# Altium schematic sheet rampshh.SchDoc
size A3
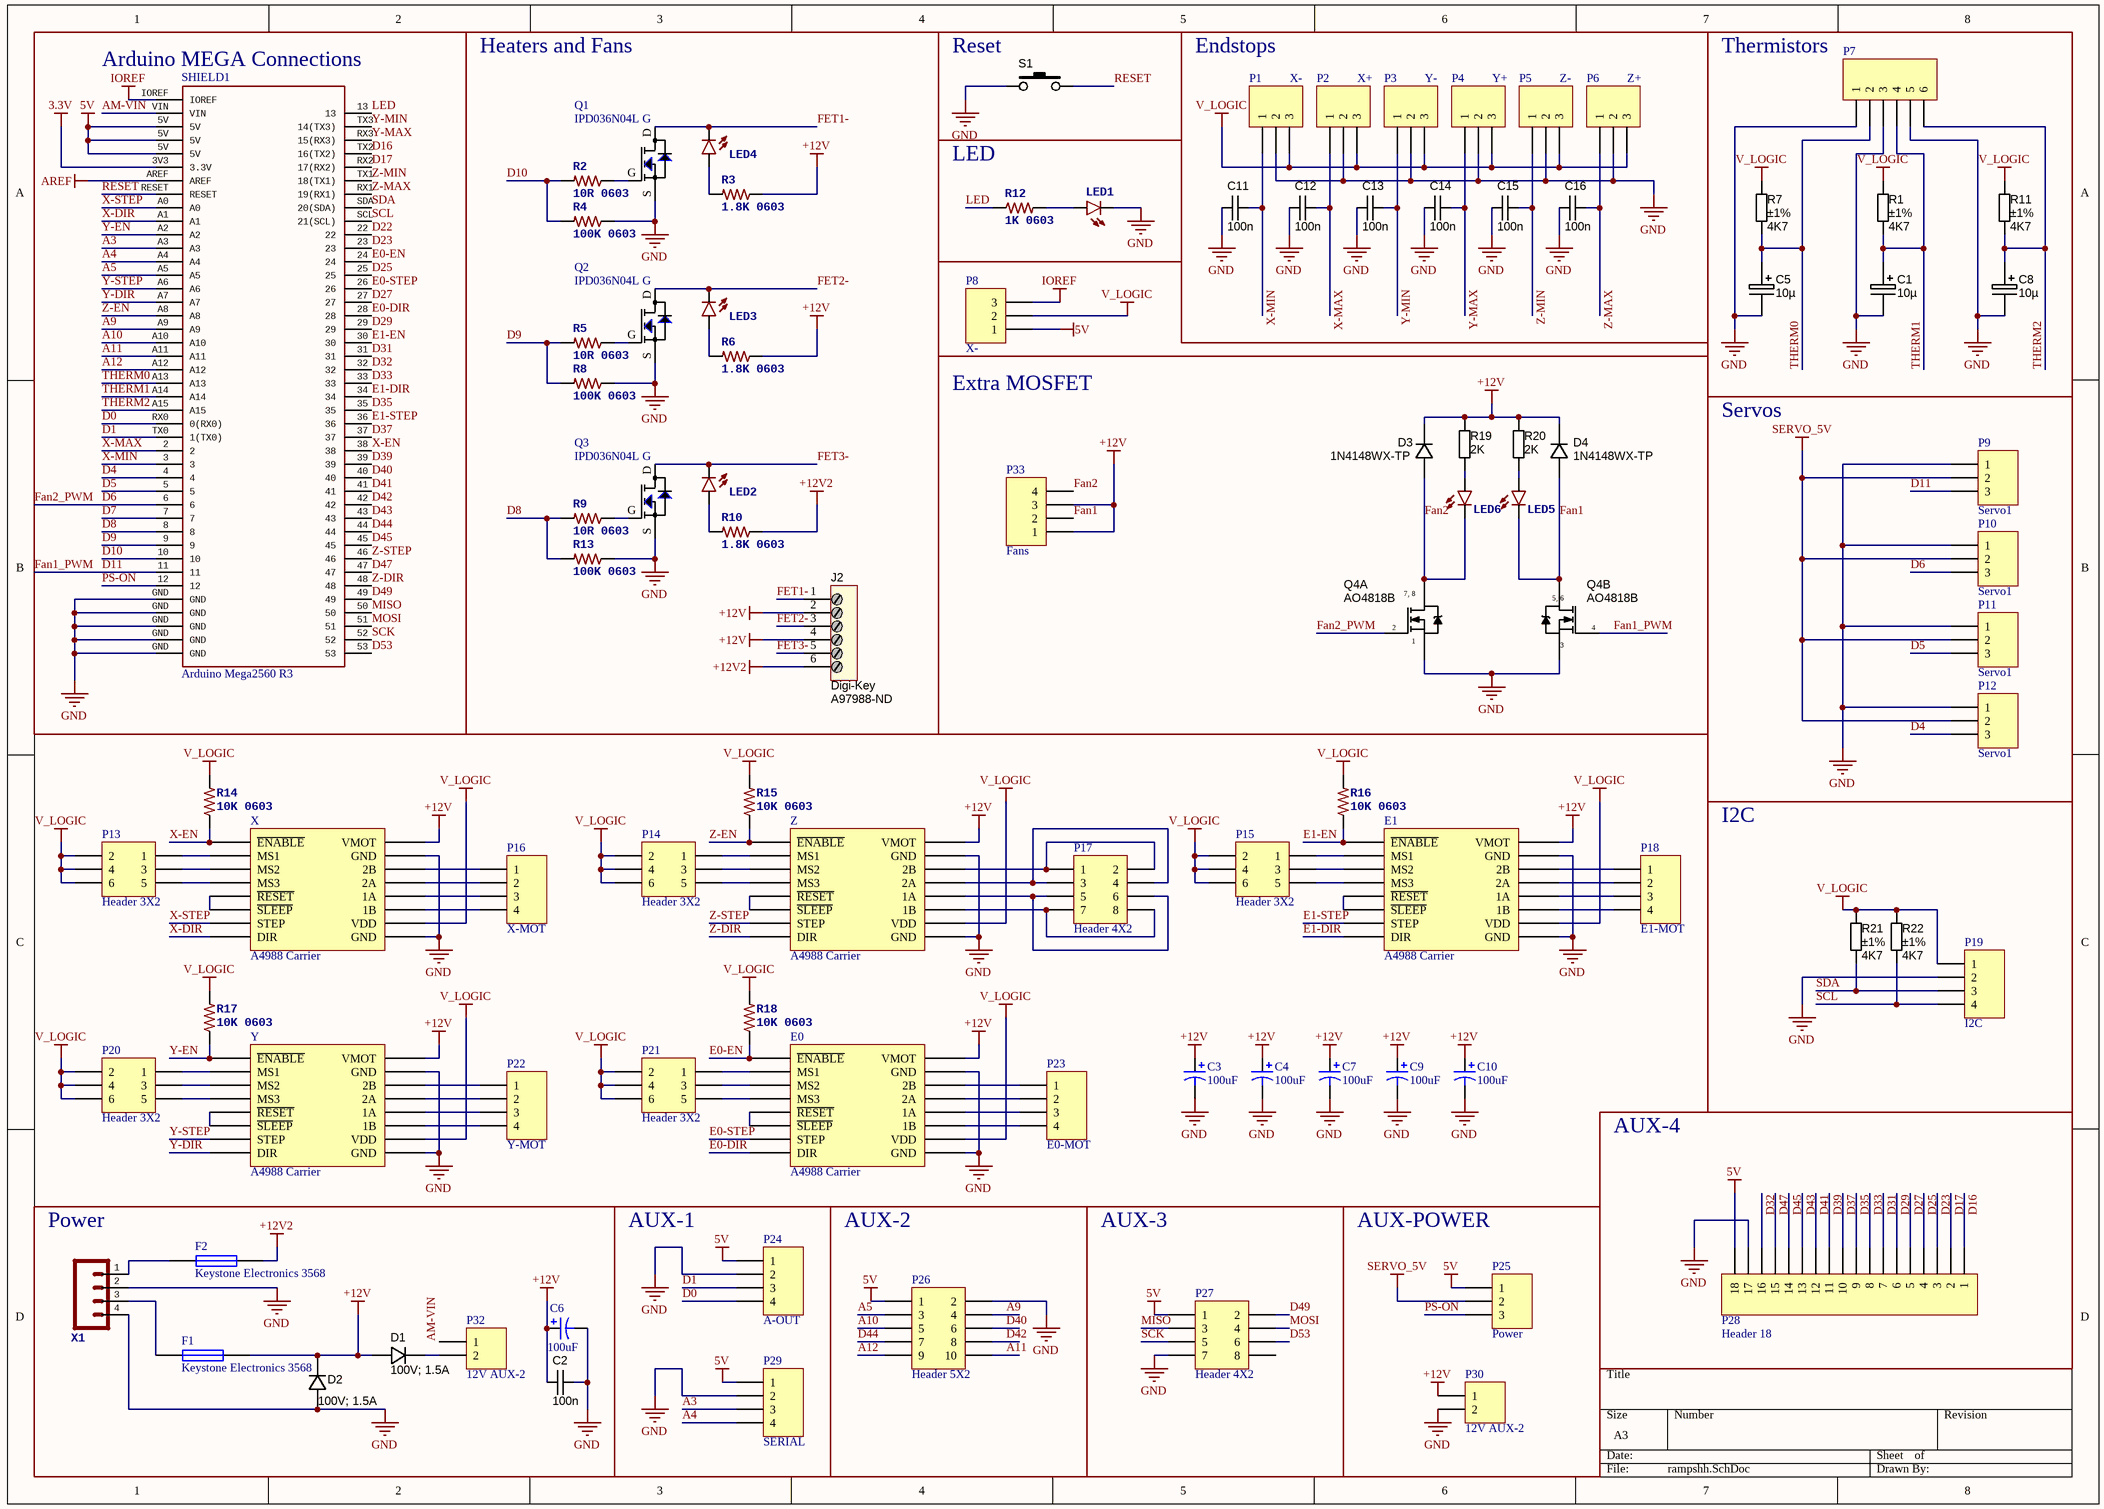
[diagram p0: rampshh.SchDoc]

## Parts
C1  10µ  [153CLV-0405]
C2  value 100n  [CAPC2012X135N]  (hidden comment: approved sub OK)
C3  100uF  [Kemet EDK107M035A9HAA]
C4  100uF  [Kemet EDK107M035A9HAA]
C5  10µ  [153CLV-0405]
C6  100uF  [Kemet EDK107M035A9HAA]
C7  100uF  [Kemet EDK107M035A9HAA]
C8  10µ  [153CLV-0405]
C9  100uF  [Kemet EDK107M035A9HAA]
C10  100uF  [Kemet EDK107M035A9HAA]
C11  value 100n  [CAPC1608X90N]  (hidden comment: approved sub OK)
C12  value 100n  [CAPC1608X90N]  (hidden comment: approved sub OK)
C13  value 100n  [CAPC1608X90N]  (hidden comment: approved sub OK)
C14  value 100n  [CAPC1608X90N]  (hidden comment: approved sub OK)
C15  value 100n  [CAPC1608X90N]  (hidden comment: approved sub OK)
C16  value 100n  [CAPC1608X90N]  (hidden comment: approved sub OK)
D1  100V; 1.5A  [DO-214AC]
D2  100V; 1.5A  [DO-214AC]
D3  Manufacturer Part Number: 1N4148WX-TP  [SOD323]  (hidden comment: DIODE_75V_500mW)
D4  Manufacturer Part Number: 1N4148WX-TP  [SOD323]  (hidden comment: DIODE_75V_500mW)
E0  A4988 Carrier  [A4988 Carrier]
E1  A4988 Carrier  [A4988 Carrier]
F1  Keystone Electronics 3568  [Keystone Electronics 3568 Fuse Holder]
F2  Keystone Electronics 3568  [Keystone Electronics 3568 Fuse Holder]
J2  Supplier 1: Digi-Key  Supplier Part Number 1: A97988-ND  [6P_PCB_ScrewTerm90S]  (hidden comment: 6P_ScrewTerm_90S)
LED1  Blue LEDs for production use    Various blue LEDs stocked by SparkFun production 0603 - DIO-08575 Rebel - DIO-09553 1206 - DIO-09911  [LED-0603]  (value not drawn)
LED2  Blue LEDs for production use    Various blue LEDs stocked by SparkFun production 0603 - DIO-08575 Rebel - DIO-09553 1206 - DIO-09911  [LED-0603]  (value not drawn)
LED3  Blue LEDs for production use    Various blue LEDs stocked by SparkFun production 0603 - DIO-08575 Rebel - DIO-09553 1206 - DIO-09911  [LED-0603]  (value not drawn)
LED4  Blue LEDs for production use    Various blue LEDs stocked by SparkFun production 0603 - DIO-08575 Rebel - DIO-09553 1206 - DIO-09911  [LED-0603]  (value not drawn)
LED5  Blue LEDs for production use    Various blue LEDs stocked by SparkFun production 0603 - DIO-08575 Rebel - DIO-09553 1206 - DIO-09911  [LED-0603]  (value not drawn)
LED6  Blue LEDs for production use    Various blue LEDs stocked by SparkFun production 0603 - DIO-08575 Rebel - DIO-09553 1206 - DIO-09911  [LED-0603]  (value not drawn)
P1  X-  [Header 3x1 Male]
P2  X+  [Header 3x1 Male]
P3  Y-  [Header 3x1 Male]
P4  Y+  [Header 3x1 Male]
P5  Z-  [Header 3x1 Male]
P6  Z+  [Header 3x1 Male]
P7  Header 6  [HDR1X6]  (value not drawn)
P8  X-  [Header 3x1 Male]
P9  Servo1  [Header 3x1 Male]
P10  Servo1  [Header 3x1 Male]
P11  Servo1  [Header 3x1 Male]
P12  Servo1  [Header 3x1 Male]
P13  Header 3X2  [Header 3x2 Male]
P14  Header 3X2  [Header 3x2 Male]
P15  Header 3X2  [Header 3x2 Male]
P16  X-MOT  [Header 4x1 Male]
P17  Header 4X2  [Header 4x2 Male]
P18  E1-MOT  [Header 4x1 Male]
P19  I2C  [Header 4x1 Male]
P20  Header 3X2  [Header 3x2 Male]
P21  Header 3X2  [Header 3x2 Male]
P22  Y-MOT  [Header 4x1 Male]
P23  E0-MOT  [Header 4x1 Male]
P24  A-OUT  [Header 4x1 Male]
P25  Power  [Header 3x1 Male]
P26  Header 5X2  [Header 5x2 Male]
P27  Header 4X2  [Header 4x2 Male]
P28  Header 18  [HDR1X18]
P29  SERIAL  [Header 4x1 Male]
P30  12V AUX-2  [Header 2x1 Male]
P32  12V AUX-2  [Header 2x1 Male]
P33  Fans  [Header 4x1 Male]
Q1  IPD036N04L G  [IPD036N04L G]
Q2  IPD036N04L G  [IPD036N04L G]
Q3  IPD036N04L G  [IPD036N04L G]
Q4  Manufacturer Part Number 1: AO4818B  [SOIC127P600X175-8AN]  (hidden comment: MOSFET_AO4818B)  (parts A,B of 2)
R1  value 4K7  Tolerance: ±1%  [RESC2012X70N]  (hidden comment: Thick Film)
R2  10R 0603  [RESC1608X55N]
R3  1.8K 0603  [0603-RES]
R4  100K 0603  [RESC1608X55N]
R5  10R 0603  [RESC1608X55N]
R6  1.8K 0603  [0603-RES]
R7  value 4K7  Tolerance: ±1%  [RESC2012X70N]  (hidden comment: Thick Film)
R8  100K 0603  [RESC1608X55N]
R9  10R 0603  [RESC1608X55N]
R10  1.8K 0603  [0603-RES]
R11  value 4K7  Tolerance: ±1%  [RESC2012X70N]  (hidden comment: Thick Film)
R12  1K 0603  [0603-RES]
R13  100K 0603  [RESC1608X55N]
R14  10K 0603  [0603-RES]
R15  10K 0603  [0603-RES]
R16  10K 0603  [0603-RES]
R17  10K 0603  [0603-RES]
R18  10K 0603  [0603-RES]
R19  value 2K  [RESC1608X55N]  (hidden comment: Thick Film)
R20  value 2K  [RESC1608X55N]  (hidden comment: Thick Film)
R21  value 4K7  Tolerance: ±1%  [RESC2012X70N]  (hidden comment: Thick Film)
R22  value 4K7  Tolerance: ±1%  [RESC2012X70N]  (hidden comment: Thick Film)
S1  SW_THT_PB_4.3mm  [FSMRACD]  (value not drawn)
SHIELD1  Arduino Mega2560 R3  [Arduino Mega Shield - No Text]
X  A4988 Carrier  [A4988 Carrier]
X1  Header 4Standard 4-pin 0.1" header. Use with straight break away headers (SKU : PRT-00116), right angle break away headers (PRT-00553), swiss pins (PRT-00743), machine pins (PRT-00117), and female headers (PRT-00115). Molex polarized connector foot print use with SKU : PRT-08231 with associated crimp pins and housings. 1MM SMD Version SKU: PRT-10208  [MSTBA4]  (value not drawn)
Y  A4988 Carrier  [A4988 Carrier]
Z  A4988 Carrier  [A4988 Carrier]

## Blocks framed on the sheet
Arduino MEGA Connections: SHIELD1
Heaters and Fans: J2 LED2-LED4 Q1-Q3 R2-R6 R8-R10 R13
Reset: S1
Endstops: C11-C16 P1-P6
Thermistors: C1 C5 C8 P7 R1 R7 R11
LED: LED1 R12
Extra MOSFET: D3 D4 LED5 LED6 P33 Q4 R19 R20
Servos: P9-P12
I2C: P19 R21 R22
AUX-4: P28
Power: C2 C6 D1 D2 F1 F2 P32 X1
AUX-1: P24 P29
AUX-2: P26
AUX-3: P27
AUX-POWER: P25 P30

## Nets
3.3V: SHIELD1.3V3(3.3V)
5V: P8.1 P24.1 P25.1 P26.1 P27.1 P28.18 P29.1 SHIELD1.5V
+12V: C2.1 C3.1 C4.1 C6.1 C7.1 C9.1 C10.1 D1.A D2.K D3.K D4.K E0.VMOT E1.VMOT F1.2 J2.2 J2.4 P30.1 P33.1 P33.3 R3.1 R6.1 R19.1 R20.1 X.VMOT Y.VMOT Z.VMOT
+12V2: F2.2 J2.6 R10.1
AREF: SHIELD1.AREF
GND: C1.- C2.2 C3.2 C4.2 C5.- C6.2 C7.2 C8.- C9.2 C10.2 C11.1 C12.1 C13.1 C14.1 C15.1 C16.1 D2.A E0.GND E0.GND2(GND) E1.GND E1.GND2(GND) LED1.C P1.2 P2.2 P3.2 P4.2 P5.2 P6.2 P7.1 P7.3 P7.5 P9.1 P10.1 P11.1 P12.1 P19.2 P24.2 P26.2 P27.7 P28.17 P29.2 P30.2 Q1.S Q2.S Q3.S Q4.1(S) Q4.3(S) R4.1 R8.1 R13.1 S1.1 SHIELD1.GND X.GND X.GND2(GND) X1.2 X1.4 Y.GND Y.GND2(GND) Z.GND Z.GND2(GND)
IOREF: P8.3 SHIELD1.IOREF
SERVO_5V: P9.2 P10.2 P11.2 P12.2 P25.2
V_LOGIC: E0.Vdd(VDD) E1.Vdd(VDD) P1.3 P2.3 P3.3 P4.3 P5.3 P6.3 P8.2 P13.2 P13.4 P13.6 P14.2 P14.4 P14.6 P15.2 P15.4 P15.6 P19.1 P20.2 P20.4 P20.6 P21.2 P21.4 P21.6 R1.1 R7.1 R11.1 R14.2 R15.2 R16.2 R17.2 R18.2 R21.1 R22.1 X.Vdd(VDD) Y.Vdd(VDD) Z.Vdd(VDD)
A3: P29.3 SHIELD1.A3
A4: P29.4 SHIELD1.A4
A5: P26.3 SHIELD1.A5
A9: P26.4 SHIELD1.A9
A10: P26.5 SHIELD1.A10
A11: P26.10 SHIELD1.A11
A12: P26.9 SHIELD1.A12
AM-VIN: P32.1 SHIELD1.VIN
D0: P24.4 SHIELD1.RX0(0(RX0))
D1: P24.3 SHIELD1.TX0(1(TX0))
D4: P12.3 SHIELD1.4
D5: P11.3 SHIELD1.5
D6: P10.3 Q4.2(G) SHIELD1.6  [also labelled Fan2_PWM]
D7: SHIELD1.7
D8: R9.2 R13.2 SHIELD1.8
D9: R5.2 R8.2 SHIELD1.9
D10: R2.2 R4.2 SHIELD1.10
D11: P9.3 Q4.4(G) SHIELD1.11  [also labelled Fan1_PWM]
D16: P28.1 SHIELD1.TX2(16(TX2))
D17: P28.2 SHIELD1.RX2(17(RX2))
D22: SHIELD1.22
D23: P28.3 SHIELD1.23
D25: P28.4 SHIELD1.25
D27: P28.5 SHIELD1.27
D29: P28.6 SHIELD1.29
D31: P28.7 SHIELD1.31
D32: P28.16 SHIELD1.32
D33: P28.8 SHIELD1.33
D35: P28.9 SHIELD1.35
D37: P28.10 SHIELD1.37
D39: P28.11 SHIELD1.39
D40: P26.6 SHIELD1.40
D41: P28.12 SHIELD1.41
D42: P26.8 SHIELD1.42
D43: P28.13 SHIELD1.43
D44: P26.7 SHIELD1.44
D45: P28.14 SHIELD1.45
D47: P28.15 SHIELD1.47
D49: P27.2 SHIELD1.49
D53: P27.6 SHIELD1.53
E0-DIR: E0.DIR SHIELD1.28
E0-EN: E0.ENABLE(~{ENABLE}) R18.1 SHIELD1.24
E0-STEP: E0.STEP SHIELD1.26
E1-DIR: E1.DIR SHIELD1.34
E1-EN: E1.ENABLE(~{ENABLE}) R16.1 SHIELD1.30
E1-STEP: E1.STEP SHIELD1.36
Fan1: D4.A LED5.C P33.2 Q4.5(D) Q4.6(D)
Fan2: D3.A LED6.C P33.4 Q4.7(D) Q4.8(D)
FET1-: J2.1 LED4.C Q1.D
FET2-: J2.3 LED3.C Q2.D
FET3-: J2.5 LED2.C Q3.D
LED: R12.1 SHIELD1.13
MISO: P27.3 SHIELD1.50
MOSI: P27.4 SHIELD1.51
PS-ON: P25.3 SHIELD1.12
RESET: S1.2 SHIELD1.RESET
SCK: P27.5 SHIELD1.52
SCL: P19.4 R22.2 SHIELD1.SCL(21(SCL))
SDA: P19.3 R21.2 SHIELD1.SDA(20(SDA))
THERM0: C5.+ P7.2 R7.2 SHIELD1.A13
THERM1: C1.+ P7.4 R1.2 SHIELD1.A14
THERM2: C8.+ P7.6 R11.2 SHIELD1.A15
X-DIR: SHIELD1.A1 X.DIR
X-EN: R14.1 SHIELD1.38 X.ENABLE(~{ENABLE})
X-MAX: C12.2 P2.1 SHIELD1.2
X-MIN: C11.2 P1.1 SHIELD1.3
X-STEP: SHIELD1.A0 X.STEP
Y-DIR: SHIELD1.A7 Y.DIR
Y-EN: R17.1 SHIELD1.A2 Y.ENABLE(~{ENABLE})
Y-MAX: C14.2 P4.1 SHIELD1.RX3(15(RX3))
Y-MIN: C13.2 P3.1 SHIELD1.TX3(14(TX3))
Y-STEP: SHIELD1.A6 Y.STEP
Z-DIR: SHIELD1.48 Z.DIR
Z-EN: R15.1 SHIELD1.A8 Z.ENABLE(~{ENABLE})
Z-MAX: C16.2 P6.1 SHIELD1.RX1(19(RX1))
Z-MIN: C15.2 P5.1 SHIELD1.TX1(18(TX1))
Z-STEP: SHIELD1.46 Z.STEP
NetD1_K: D1.K P32.2
NetE0_1A: E0.1A P23.3
NetE0_1B: E0.1B P23.4
NetE0_2A: E0.2A P23.2
NetE0_2B: E0.2B P23.1
NetE0_MS1: E0.MS1 P21.1
NetE0_MS2: E0.MS2 P21.3
NetE0_MS3: E0.MS3 P21.5
NetE0_RESET: E0.RESET(~{RESET}) E0.SLEEP(~{SLEEP})
NetE1_1A: E1.1A P18.3
NetE1_1B: E1.1B P18.4
NetE1_2A: E1.2A P18.2
NetE1_2B: E1.2B P18.1
NetE1_MS1: E1.MS1 P15.1
NetE1_MS2: E1.MS2 P15.3
NetE1_MS3: E1.MS3 P15.5
NetE1_RESET: E1.RESET(~{RESET}) E1.SLEEP(~{SLEEP})
NetF1_1: F1.1 X1.3
NetF2_1: F2.1 X1.1
NetLED1_A: LED1.A R12.2
NetLED2_A: LED2.A R10.2
NetLED3_A: LED3.A R6.2
NetLED4_A: LED4.A R3.2
NetLED5_A: LED5.A R20.2
NetLED6_A: LED6.A R19.2
NetP13_1: P13.1 X.MS1
NetP13_3: P13.3 X.MS2
NetP13_5: P13.5 X.MS3
NetP14_1: P14.1 Z.MS1
NetP14_3: P14.3 Z.MS2
NetP14_5: P14.5 Z.MS3
NetP16_1: P16.1 X.2B
NetP16_2: P16.2 X.2A
NetP16_3: P16.3 X.1A
NetP16_4: P16.4 X.1B
NetP17_1: P17.1 P17.2 Z.2B
NetP17_3: P17.3 P17.4 Z.2A
NetP17_5: P17.5 P17.6 Z.1A
NetP17_7: P17.7 P17.8 Z.1B
NetP20_1: P20.1 Y.MS1
NetP20_3: P20.3 Y.MS2
NetP20_5: P20.5 Y.MS3
NetP22_1: P22.1 Y.2B
NetP22_2: P22.2 Y.2A
NetP22_3: P22.3 Y.1A
NetP22_4: P22.4 Y.1B
NetQ1_G: Q1.G R2.1
NetQ2_G: Q2.G R5.1
NetQ3_G: Q3.G R9.1
NetX_RESET: X.RESET(~{RESET}) X.SLEEP(~{SLEEP})
NetY_RESET: Y.RESET(~{RESET}) Y.SLEEP(~{SLEEP})
NetZ_RESET: Z.RESET(~{RESET}) Z.SLEEP(~{SLEEP})

Not connected (* = marked no-connect by the designer): P27 8

## Notes on the sheet
- (in symbol MOSFET_AO4818B, part A) 7, 8
- (in symbol MOSFET_AO4818B, part B) 5, 6

## Library data of the parts
C1 C5 C8 = CAPE_10u_100V_SMD: Capacitor SMD Electrolytic 10uF 20% 100V Radial; Manufacturer: Panasonic - ECG; Manufacturer Part Number: EEE-2AA100UP; Ratings: 16V; Material: Aluminum Electrolytic; SCDType: spec; Package / Case: Radial - Surface Mount; Tolerance: ±20%; Supplier 1: Digi-Key; Supplier Part Number 1: PCE3966CT-ND; Value: 10µ
C2 = CAPC_100n_0805_X7R_50V_10%: Capacitor SMD Cer 100nF 10% 50V X7R 0805; Manufacturer 1: Kemet; Manufacturer Part Number 1: C0805C104K5RACTU; Ratings: 50V; X7R; Material: ceramic; SCDType: undef; Package / Case: 0805 (2012 metric); Tolerance: ±10%; Supplier 1: Digi-Key; Supplier Part Number 1: 399-1170-1-ND
C3 C4 C6 C7 C9 C10 = Cap Pol1: Polarized Capacitor (Radial); Published: 8-Jun-2000; LatestRevisionDate: 17-Jul-2002; LatestRevisionNote: Re-released for DXP Platform.; PackageReference: RB7.6-15; Publisher: Altium Limited; PackageDescription: Polarized Capacitor (Radial); 2 Leads; Value: 100uF; Digikey: 399-6671-1-ND
C11-C16 = CAPC_100n_0603_X7R_50V_10%: Capacitor SMD Cer 100nF 10% 50V X7R 0603; Manufacturer 1: AVX Corporation; Manufacturer Part Number 1: 06035C104KAT2A; Ratings: 50V; X7R; Material: ceramic; SCDType: spec; Manufacturer 2: TDK Corporation; Manufacturer Part Number 2: C1608X7R1H104K; Package / Case: 0603 (1608 Metric); Tolerance: ±10%; Supplier 1: Digi-Key; Supplier Part Number 1: 478-5052-1-ND; ComponentLink1URL: http://www.avx.com/docs/Catalogs/cx7r.pdf; ComponentLink1Description: http://www.avx.com/docs/Catalogs/cx7r.pdf; Supplier 2: Digi-Key; Supplier Part Number 2: 445-1314-1-ND; ComponentLink2URL: http://product.tdk.com/capacitor/mlcc/en/documents/mlcc_commercial_general_en.pdf; ComponentLink2Description: http://product.tdk.com/capacitor/mlcc/en/documents/mlcc_commercial_general_en.pdf
D1 D2 = DIODE_100V_1.5A_SMA: Diode SMD 100V 1.5A SMA; Manufacturer 1: Diodes Inc; Manufacturer Part Number 1: S2BA-13-F; Material: Si; Diode Type: Standard; Value: Vf = 1.15V @ 1.5A (Max); SCDType: source; Package / Case: DO-214AC, SMA; Ratings: 100V; 1.5A; Supplier 1: Digi-Key; Supplier Part Number 1: S2BA-FDICT-ND
D3 D4 = DIODE_75V_500mW: Diode SMD 300mA 0.5W SOD323; Manufacturer: Micro Commercial Co; Ratings: 75V; 300mA; 0.5W; Material: Si; Diode Type: Standard; Value: Vf=1V @ 50mA; SCDType: source; Package / Case: SOD323; Supplier 1: Digi-Key; Supplier Part Number 1: 1N4148WXTPMSCT-ND
F1 F2 = Fuse 1: Fuse; Published: 8-Jun-2000; LatestRevisionDate: 17-Jul-2002; LatestRevisionNote: Re-released for DXP Platform.; PackageReference: PIN-W2/E2.8; Publisher: Altium Limited; PackageDescription: Thru-Hole; 2 Leads; Digikey: 36-3568-ND
J2 = 6P_ScrewTerm_90S: TERM BLOCK 6POS SIDE ENT STACKABLE 5.08MM; Manufacturer 1: Tyco Electronics; Manufacturer Part Number 1: 1776119-6; Current: 10A; Mating Orientation: Horizontal with Board; Pitch: 0.200" (5.08mm); Voltage: 300V; Wire Gauge: 15-17 AWG; Number of Levels: 1; Positions Per Level: 6; SCDType: undef; Category: Connectors Interconnects; Color: Black; Features: -; Mounting Type: Through Hole; Terminal Block Type: Wire to Board; Termination: Screw; ComponentLink1URL: http://documents.tycoelectronics.com/commerce/DocumentDelivery/DDEController?Action=srchrtrv&DocNm=1776119&DocType=CD&DocLang=EN; ComponentLink1Description: http://documents.tycoelectronics.com/commerce/DocumentDelivery/DDEController?Action=srchrtrv&DocNm=1776119&DocType=CD&DocLang=EN; Package / Case: Side Entry; 5.08mm pitch
LED1-LED6 = LED-BLUE0603: PROD_ID: DIO-08575
P1-P6 P8-P12 P25 = Header 3: Header, 3-Pin; LatestRevisionDate: 17-Jul-2002; LatestRevisionNote: Re-released for DXP Platform.; Publisher: Altium Limited
P7 = Header 6: Header, 6-Pin; LatestRevisionDate: 17-Jul-2002; LatestRevisionNote: Re-released for DXP Platform.; Publisher: Altium Limited
P13-P15 P20 P21 = Header 3X2: Header, 3-Pin, Dual row; LatestRevisionDate: 17-Jul-2002; LatestRevisionNote: Re-released for DXP Platform.; Publisher: Altium Limited
P16 P18 P19 P22-P24 P29 P33 = Header 4: Header, 4-Pin; LatestRevisionDate: 17-Jul-2002; LatestRevisionNote: Re-released for DXP Platform.; Publisher: Altium Limited
P17 P27 = Header 4X2: Header, 4-Pin, Dual row; LatestRevisionDate: 17-Jul-2002; LatestRevisionNote: Re-released for DXP Platform.; Publisher: Altium Limited
P26 = Header 5X2: Header, 5-Pin, Dual row; LatestRevisionDate: 17-Jul-2002; LatestRevisionNote: Re-released for DXP Platform.; Publisher: Altium Limited
P28 = Header 18: Header, 18-Pin; LatestRevisionDate: 17-Jul-2002; LatestRevisionNote: Re-released for DXP Platform.; Publisher: Altium Limited
P30 P32 = Header 2: Header, 2-Pin; LatestRevisionDate: 17-Jul-2002; LatestRevisionNote: Re-released for DXP Platform.; Publisher: Altium Limited
Q4 = MOSFET_AO4818B: MOSFET Dual-Channel 30V 8.5A SOIC-8 SMD; Manufacturer 1: Alpha & Omega Semiconductor Inc; Ratings: 2W; 30V; 8.5A; 16 mOhm; Material: Silicon; SCDType: source; Package / Case: SOIC-8; Supplier 1: Digi-Key; Supplier Part Number 1: 785-1059-1-ND
R1 R7 R11 R21 R22 = RES_4K7_0805_1%: Resistor SMD chip 4.7k Ohm 0.125W 1% 0805; Manufacturer 1: Vishay/Dale; Manufacturer Part Number 1: CRCW08054K70FKEA; Ratings: 1/8W; SCDType: spec; Package / Case: 0805 (2012 metric); Supplier 1: Digi-Key; Supplier Part Number 1: 541-4.70KCCT-ND
R2-R6 R8-R10 R12-R18 = 1KOHM-1/10W-1%(0603): PROD_ID: RES-07856
R19 R20 = RES_330R_0603_5%: Resistor SMD chip 330 Ohm 0.1W 5% 0603; Manufacturer 1: Vishay Dale; Manufacturer Part Number 1: CRCW0603330RJNEA; Ratings: 1/10 W; SCDType: spec; Manufacturer 2: Yageo; Manufacturer Part Number 2: RC0603JR-07330RL; Package / Case: 0603 (1608 metric); Tolerance: ±5%; Material: Thick Film; Supplier 1: Digi-Key; Supplier Part Number 1: 541-330GCT-ND; ComponentLink1URL: http://www.vishay.com/doc?20035; ComponentLink1Description: http://www.vishay.com/doc?20035; Supplier 2: Digi-Key; Supplier Part Number 2: 311-330GRCT-ND; ComponentLink2URL: http://www.yageo.com/documents/recent/PYu-RC0603_51_RoHS_L_4.pdf; ComponentLink2Description: http://www.yageo.com/documents/recent/PYu-RC0603_51_RoHS_L_4.pdf; Supplier: http://au.rs-online.com/web/p/surface-mount-fixed-resistors/6790226/
S1 = SW_THT_PB_4.3mm: Switch, tact, 4.3mm stem; Manufacturer 1: Bond-Tact; Manufacturer Part Number 1: TS-1143-WP-300; Function: Speed; SCDType: spec; Package / Case: 6.5x6.5mm; 4.3mm stem; Material: Brass/Nylon/Ag plating
X1 = M04SCREW: PROD_ID: Combine 2x8399